# EAGLE design MagEnc2 (EAGLE 5.11)
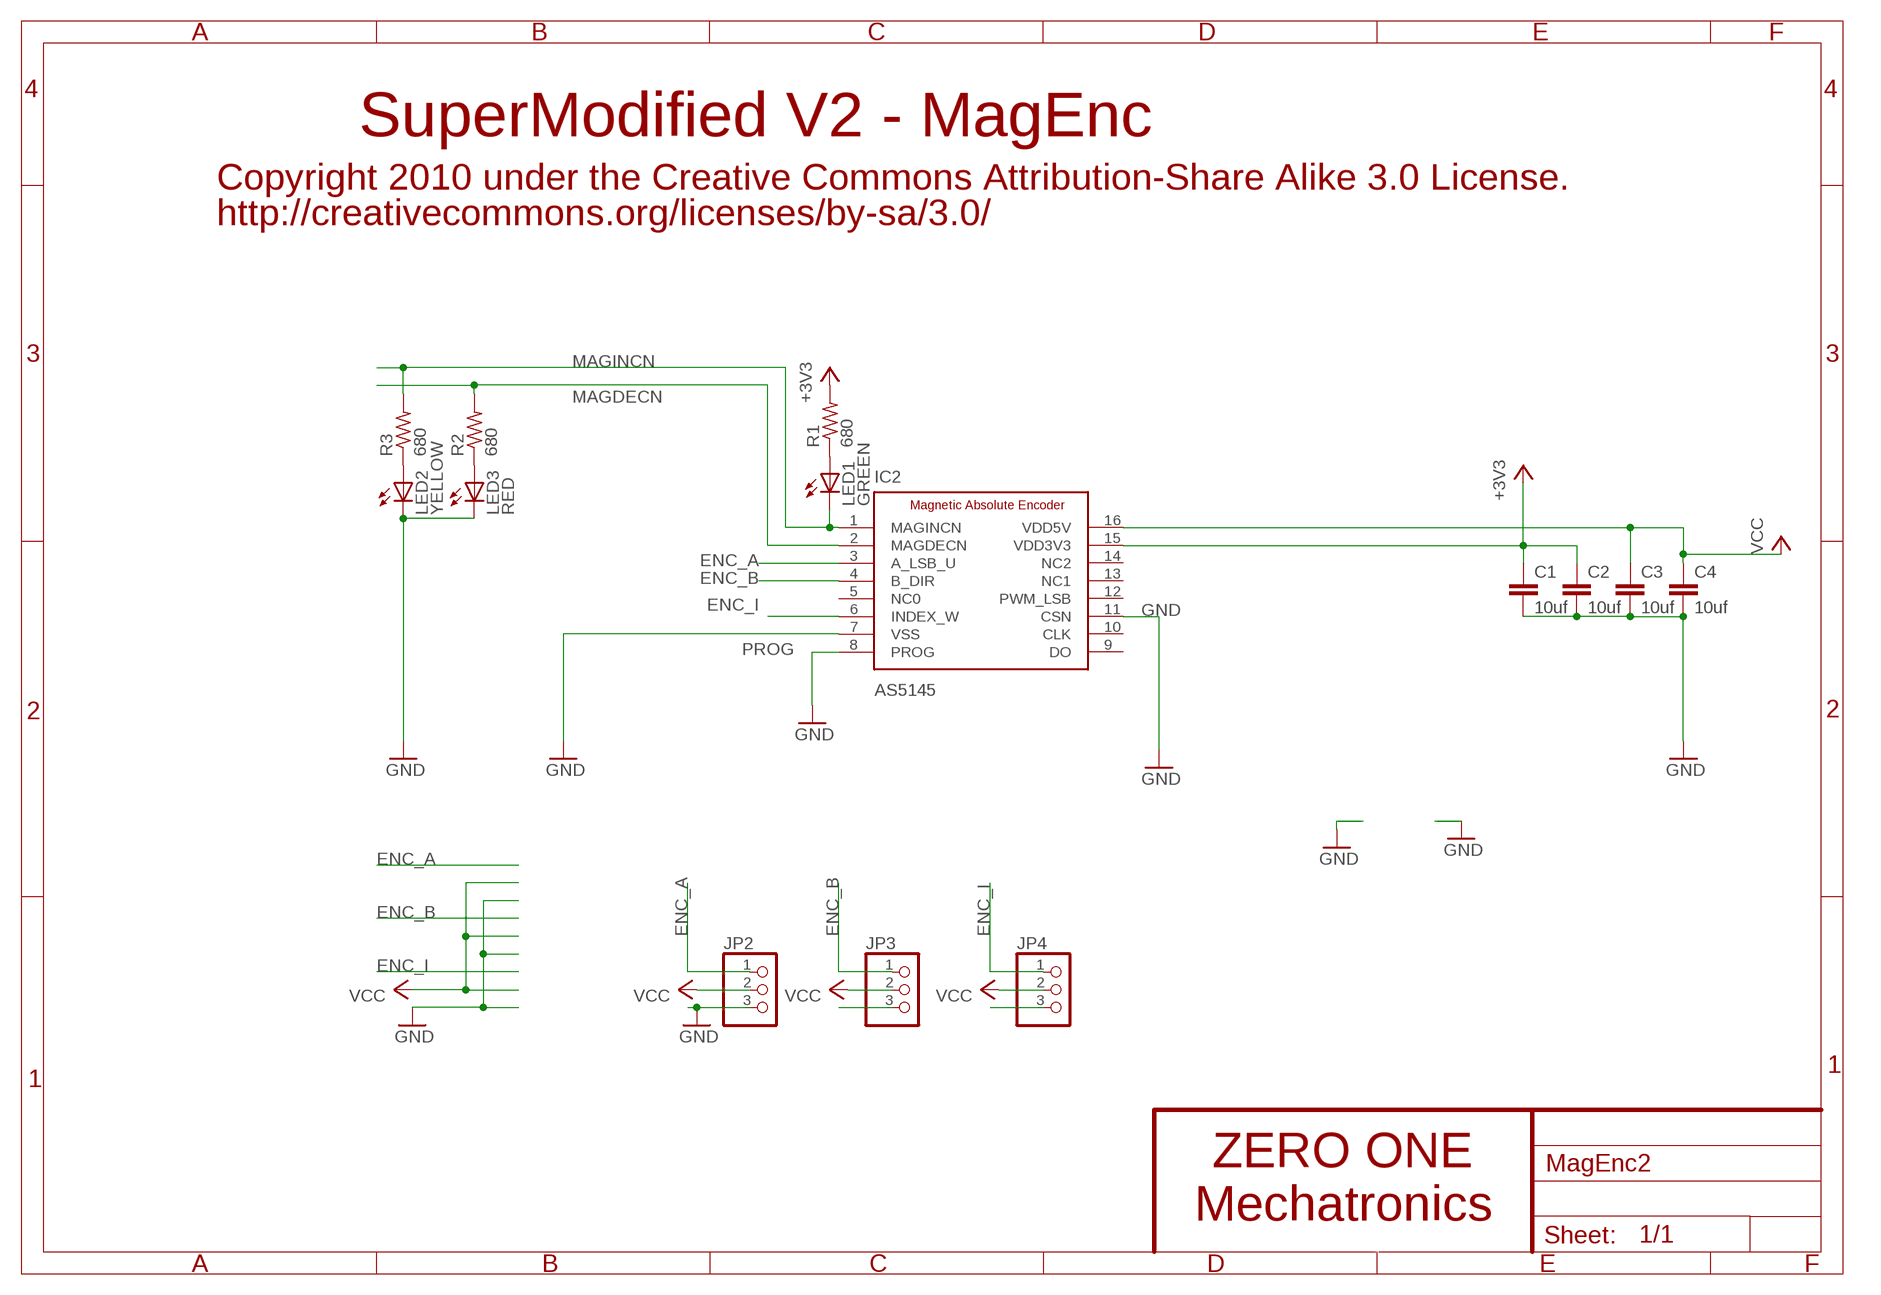
[diagram p0: schematic, sheet 1]

## Parts
C1  10uf  C-EUC0805K  [C0805K]
C2  10uf  C-EUC0805K  [C0805K]
C3  10uf  C-EUC0805K  [C0805K]
C4  10uf  C-EUC0805K  [C0805K]
IC2  AS5145  ADS5040  [SSOP16]
JP2  PINHD-1X3  [1X03]
JP3  PINHD-1X3  [1X03]
JP4  PINHD-1X3  [1X03]
LED1  GREEN  LEDCHIPLED_0805  [CHIPLED_0805]
LED2  YELLOW  LEDCHIPLED_0805  [CHIPLED_0805]
LED3  RED  LEDCHIPLED_0805  [CHIPLED_0805]
R1  680  R-US_R0603  [R0603]
R2  680  R-US_R0603  [R0603]
R3  680  R-US_R0603  [R0603]

## Nets
+3V3: C1.1 C2.1 IC2.15(VDD3V3) R1.2
ENC_A: IC2.3(A_LSB_U) JP2.1
ENC_B: IC2.4(B_DIR) JP3.1
ENC_I: IC2.6(INDEX_W) JP4.1
GND: C1.2 C2.2 C3.2 C4.2 IC2.7(VSS) IC2.11(CSN) JP2.3 LED2.C LED3.C
MAGDECN: IC2.2(MAGDECN) R2.2
MAGINCN: IC2.1(MAGINCN) LED1.C R3.2
N$1: LED1.A R1.1
N$2: JP3.3
N$3: JP4.3
N$4: LED3.A R2.1
N$5: LED2.A R3.1
PROG: IC2.8(PROG) ; supply symbol labelled GND
VCC: C3.1 C4.1 IC2.16(VDD5V) JP2.2 JP3.2 JP4.2
Unconnected: IC2.5(NC0) IC2.9(DO) IC2.10(CLK) IC2.12(PWM_LSB) IC2.13(NC1) IC2.14(NC2)

## Notes on the sheet
- SuperModified V2 - MagEnc
- Copyright 2010 under the Creative Commons Attribution-Share Alike 3.0 License.
- http://creativecommons.org/licenses/by-sa/3.0/
- ZERO ONE
- Mechatronics

## Library data of the parts
C1-C4 = rcl:C-EU: CAPACITOR, European symbol
IC2 = zo_TMS320DMC:ADS5040
JP2-JP4 = pinhead:PINHD-1X3: PIN HEADER
LED1-LED3 = led:LED: LED OSRAM: - CHIPLED LG R971, LG N971, LY N971, LG Q971, LY Q971, LO R971, LY R971 LH N974, LH R974 LS Q976, LO Q976, LY Q976 LO Q996 - Hyper CHIPLED LW Q18S LB Q993, LB Q99A, LB R99A - SideLED LS A670, LO A670, LY A670, LG A670, LP A670 LB A673, LV A673, LT A673, LW A673 LH A674 LY A675 LS A676, LA A676, LO A676, LY A676, LW A676 LS A679, LY A679, LG A679 - Hyper Micro SIDELED® LS Y876, LA Y876, LO Y876, LY Y876 LT Y87S - SmartLED LW L88C, LW L88S LB L89C, LB L89S, LG L890 LS L89K, LO L89K, LY L89K LS L896, LA L896, LO L896, LY L896 - TOPLED LS T670, LO T670, LY T670, LG T670, LP T670 LSG T670, LSP T670, LSY T670, LOP T670, LYG T670 LG T671, LOG T671, LSG T671 LB T673, LV T673, LT T673, LW T673 LH T674 LS T676, LA T676, LO T676, LY T676, LB T676, LH T676, LSB T676, LW T676 LB T67C, LV T67C, LT T67C, LS T67K, LO T67K, LY T67K, LW E67C LS E67B, LA E67B, LO E67B, LY E67B, LB E67C, LV E67C, LT E67C LW T67C LS T679, LY T679, LG T679 LS T770, LO T770, LY T770, LG T770, LP T770 LB T773, LV T773, LT T773, LW T773 LH T774 LS E675, LA E675, LY E675, LS T675 LS T776, LA T776, LO T776, LY T776, LB T776 LHGB T686 LT T68C, LB T68C - Hyper Mini TOPLED® LB M676 - Mini TOPLED Santana® LG M470 LS M47K, LO M47K, LY M47K Source: http://www.osram.convergy.de/
R1-R3 = rcl:R-US_: RESISTOR, American symbol

## Board
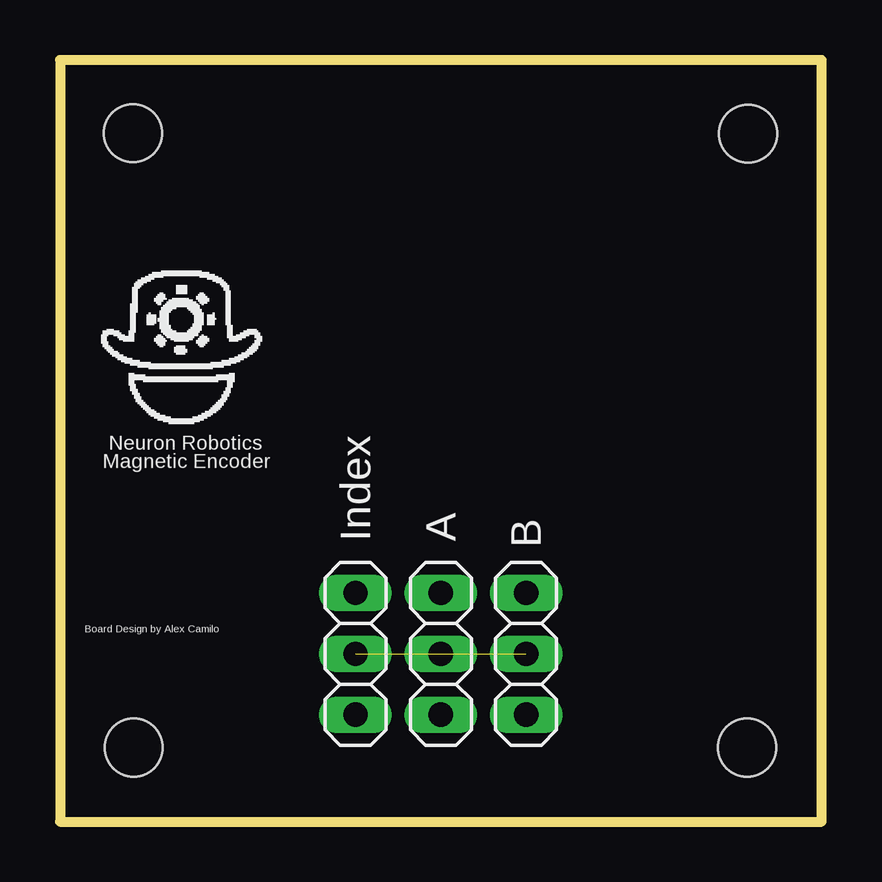
[diagram p1: board, top side]
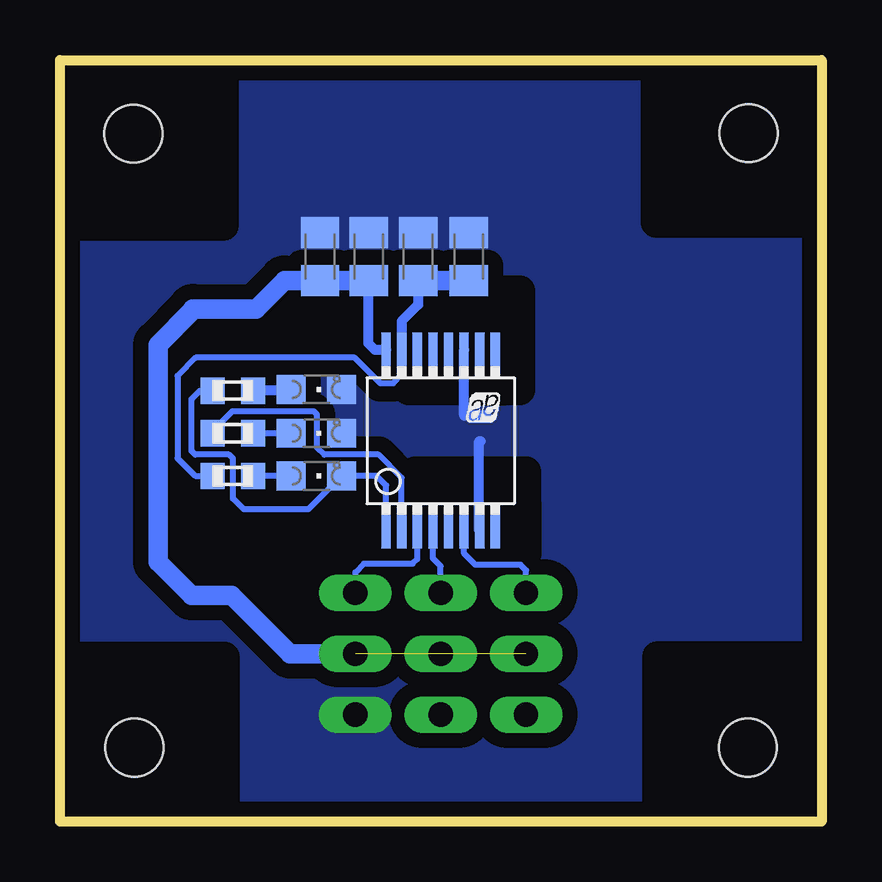
[diagram p2: board, bottom side, seen from below]

Size 31.75 x 31.75 mm. Coordinates in mm from the lower left corner, seen from the top.
Outline: 0,0 31.75,0 31.75,31.75 0,31.75 0,0
Copper layers (1*16): Top 0.035mm / dielectric 1.5mm / Bottom 0.035mm
Design rules "default *": minimum track width 10mil, minimum drill 24mil, track to track 6mil, track to pad 6mil, pad to pad 6mil, via to via 6mil, smd to smd 6mil, copper to edge 15mil, drill to drill 8mil, minimum pad ring 10mil, minimum via ring 8mil, stop-mask expansion 4mil, vias tented up to drill 0mil, thermal gap 10mil
Holes 2.41 mm at 3.05,28.7 28.69,28.68 28.65,3.08 3.07,3.08
bRestrict: area 13.4,20.9 to 16.1,21.5; area 12.6,18 to 13.2,22.1; area 13.3,18 to 14.7,18.5; area 12.3,13.3 to 16.9,14.6; area 12.3,11.2 to 13.1,13.2; area 15.1,18 to 16.5,18.5; area 15.8,18 to 17.2,18.5; area 0,25 to 6.9,31.8; area 24.9,24.8 to 31.8,31.7; area 0,0 to 6.9,6.9; area 24.9,0 to 31.8,6.9

### Footprints (pad centres in the part's own frame; a part is rotated, then mirrored left to right if it is on the bottom)
C0805K = smd 1.3 x 1.6: 1 -1,0; 2 1,0
SSOP16 = smd 0.381 x 1.422: 1 -2.275,-3.791; 2 -1.625,-3.791; 3 -0.975,-3.791; 4 -0.325,-3.791; 5 0.325,-3.791; 6 0.975,-3.791; 7 1.625,-3.791; 8 2.275,-3.791; 9 2.275,3.791; 10 1.625,3.791; 11 0.975,3.791; 12 0.325,3.791; 13 -0.325,3.791; 14 -0.975,3.791; 15 -1.625,3.791; 16 -2.275,3.791
1X03 = drill 1.016 long: 1 -2.54,0; 2 0,0; 3 2.54,0
CHIPLED_0805 = smd 1.2 x 1.2: A 0,-1.05; C 0,1.05
R0603 = smd 1 x 1.1: 1 -0.85,0; 2 0.85,0

### Placement (x,y rotation side)
C1  16.82,23.55 90 bottom
C2  14.71,23.55 90 bottom
C3  18.87,23.55 90 bottom
C4  20.91,23.55 90 bottom
IC2  15.88,15.88 0 bottom
JP2  19.43,6.99 270 top
JP3  15.88,6.99 270 top
JP4  12.32,6.99 270 top
LED1  21.06,14.41 270 bottom
LED2  21.06,18.01 270 bottom
LED3  21.06,16.19 270 bottom
R1  24.54,14.41 180 bottom
R2  24.54,16.19 180 bottom
R3  24.54,17.96 180 bottom

### Tracks (layer width: path | path; a pad name or v marks a point on that pad's centre or on a via)
+3V3
  Bottom 0.254: R1.2 26.11,14.41 26.85,15.14 26.85,18.57 26.09,19.34 19.46,19.34 18.39,18.27 17.86,18.27 17.5,18.62 IC2.15
  Bottom 0.406: C1.1 16.82,21.55 17.5,20.86 IC2.15
  Bottom 0.813: C2.1 C1.1
ENC_A
  Bottom 0.254: IC2.3 16.85,10.94 17.05,10.75 19.08,10.75 19.43,10.39 JP2.1
ENC_B
  Bottom 0.254: IC2.4 16.2,10.97 15.88,10.65 JP3.1
ENC_I
  Bottom 0.254: IC2.6 14.9,11.17 14.43,10.7 12.55,10.7 12.32,10.47 JP4.1
GND
  Bottom 0.406: IC2.7 14.28,12.12 14.28,15.86 14.2,15.86 | IC2.11 14.9,16.92 13.97,16.92
  pour Bottom (isolate 0.635, no thermals): 0.04,31.72 31.76,31.72 31.76,30.21 31.76,0.02 0.01,0.02 0.01,31.72 0.03,31.72
MAGDECN
  Bottom 0.254: IC2.2 17.5,14.33 18.47,15.3 20.73,15.3 21.03,15.6 21.03,16.97 21.16,17.1 24.56,17.1 25.07,16.59 25.07,16.5 R2.2
MAGINCN
  Bottom 0.254: IC2.1 18.15,14.02 18.54,14.41 LED1.C 21.41,13.01 24.08,13.01 24.54,13.47 24.54,15.14 24.69,15.3 26.11,15.3 26.27,15.45 26.27,17.61 25.91,17.96 R3.2
N$1
  Bottom 0.254: LED1.A R1.1
N$4
  Bottom 0.254: LED3.A R2.1
N$5
  Bottom 0.406: LED2.A 22.11,17.96 R3.1
VCC  (2 unrouted)
  Bottom 0.254: C3.1 18.9,21.87
  Bottom 0.406: 18.9,21.87 18.9,19.95 18.63,19.67 IC2.16
  Bottom 0.813: JP2.2 22.15,6.99 24.59,9.43 26.27,9.43 27.66,10.83 27.66,19.87 26.21,21.32 26.21,21.37 23.57,21.37 22.39,22.55 C4.1 C3.1

### Text on the board
tPlace: Magnetic Encoder | Neuron Robotics | Board Design by Alex Camilo
tNames: Index | A | B